# EAGLE schematic qcd-23 (EAGLE 7.2.0)
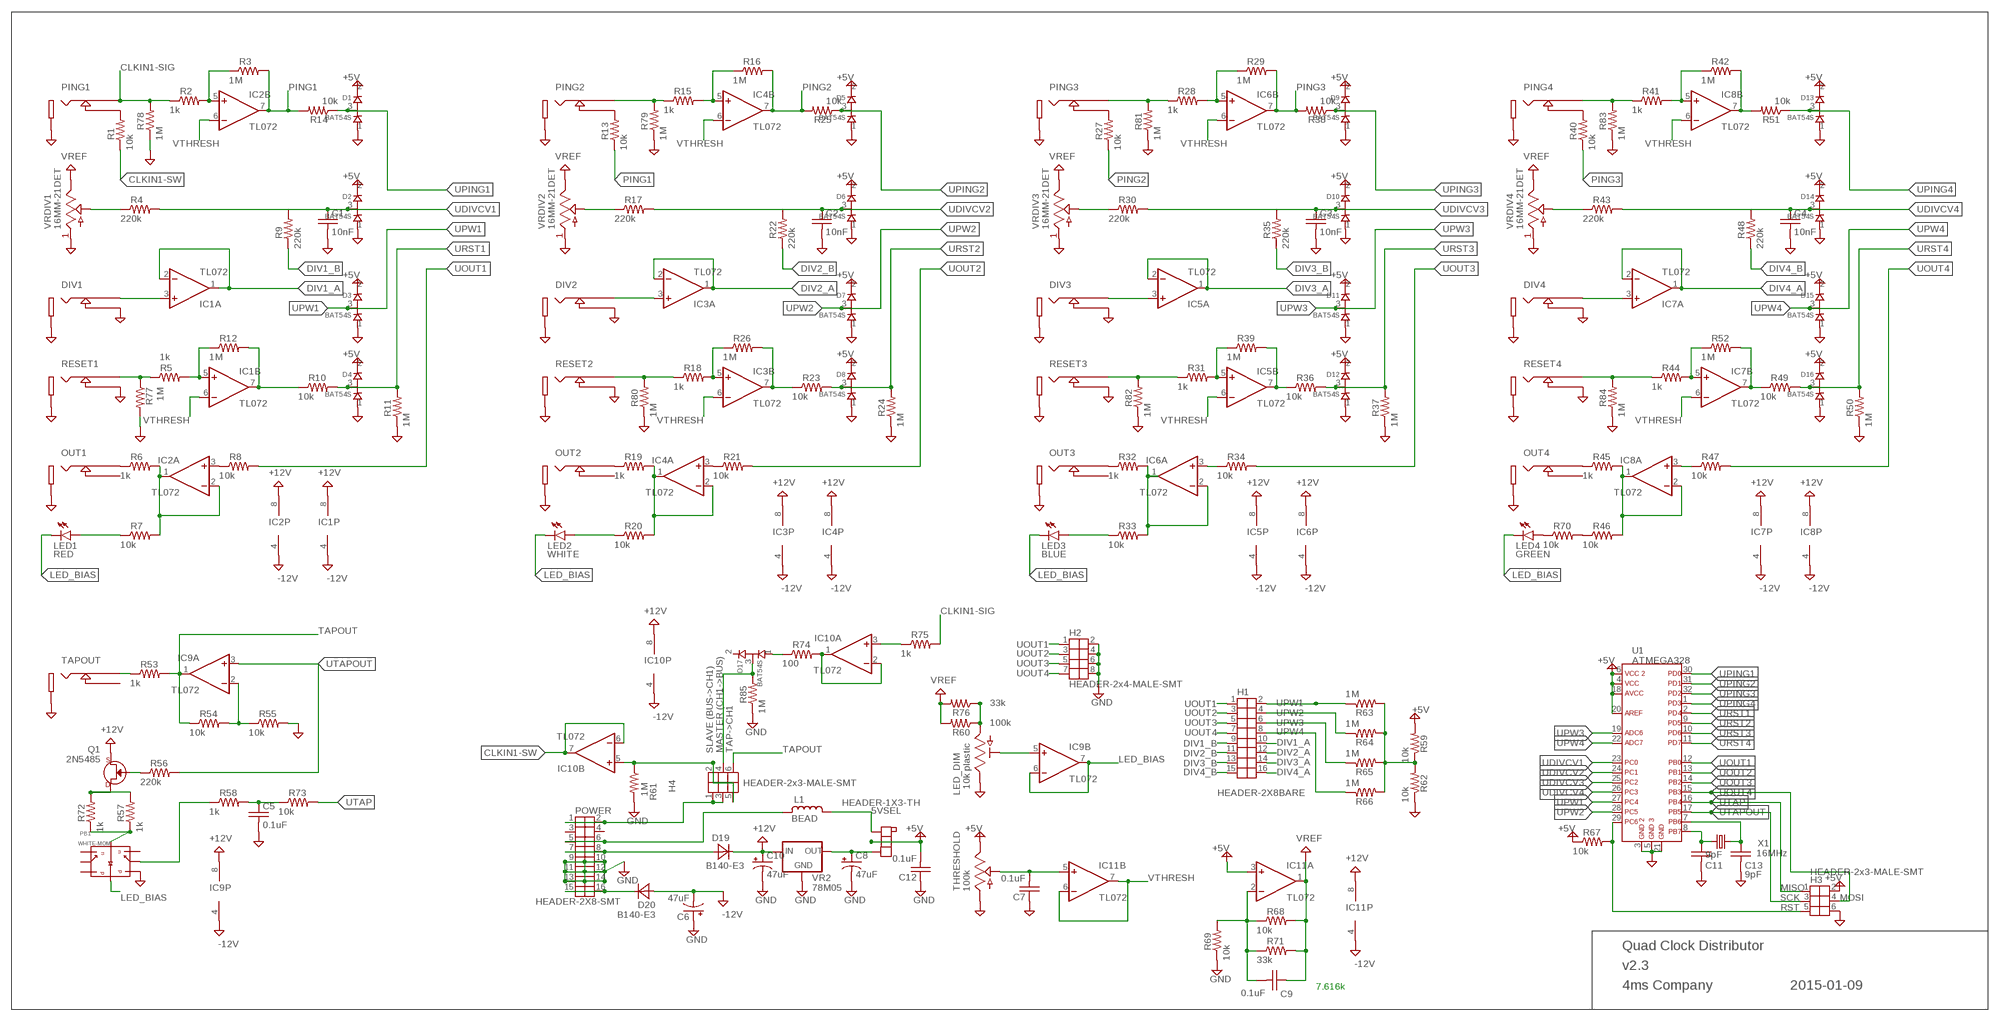
[diagram p0: schematic, sheet 1]

## Parts
5VSEL  HEADER-1X3-TH  HEADER-1X3  [HEADER-1X3-TH]
C1  10nF  CB  [C0603]
C2  10nF  CB  [C0603]
C3  10nF  CB  [C0603]
C4  10nF  CB  [C0603]
C5  0.1uF  CB  [C0603]
C6  47uF  C-POL5  [C-POL-5]
C7  0.1uF  CB  [C0603]
C8  47uF  C-POL5  [C-POL-5]
C9  0.1uF  CB  [C0603]
C10  47uF  C-POL5  [C-POL-5]
C11  9pF  CB  [C0603]
C12  0.1uF  CB  [C0603]
C13  9pF  CB  [C0603]
D1  BAT54S  DIODE-DUAL  [SOT23]
D2  BAT54S  DIODE-DUAL  [SOT23]
D3  BAT54S  DIODE-DUAL  [SOT23]
D4  BAT54S  DIODE-DUAL  [SOT23]
D5  BAT54S  DIODE-DUAL  [SOT23]
D6  BAT54S  DIODE-DUAL  [SOT23]
D7  BAT54S  DIODE-DUAL  [SOT23]
D8  BAT54S  DIODE-DUAL  [SOT23]
D9  BAT54S  DIODE-DUAL  [SOT23]
D10  BAT54S  DIODE-DUAL  [SOT23]
D11  BAT54S  DIODE-DUAL  [SOT23]
D12  BAT54S  DIODE-DUAL  [SOT23]
D13  BAT54S  DIODE-DUAL  [SOT23]
D14  BAT54S  DIODE-DUAL  [SOT23]
D15  BAT54S  DIODE-DUAL  [SOT23]
D16  BAT54S  DIODE-DUAL  [SOT23]
D17  BAT54S  DIODE-DUAL  [SOT23]
D19  B140-E3  DA  [SMA]
D20  B140-E3  DA  [SMA]
DIV1  JACK-MONO-SWM2  [PJ301M-12-FIX]
DIV2  JACK-MONO-SWM2  [PJ301M-12-FIX]
DIV3  JACK-MONO-SWM2  [PJ301M-12-FIX]
DIV4  JACK-MONO-SWM2  [PJ301M-12-FIX]
H1  HEADER-2X8BARE  [HEADER-2X8-SMT]
H2  HEADER-2x4-MALE-SMT  HEADER-2X4SMT  [HEADER-2X4-SMT]
H3  HEADER-2x3-MALE-SMT  HEADER-2X3SMT  [HEADER-2X3-SMT]
H4  HEADER-2x3-MALE-SMT  HEADER-2X3SMT  [HEADER-2X3-SMT]
IC1  TL072  OPAMP-2TL072T  [TSSOP8]
IC2  TL072  OPAMP-2TL072T  [TSSOP8]
IC3  TL072  OPAMP-2TL072T  [TSSOP8]
IC4  TL072  OPAMP-2TL072T  [TSSOP8]
IC5  TL072  OPAMP-2TL072T  [TSSOP8]
IC6  TL072  OPAMP-2TL072T  [TSSOP8]
IC7  TL072  OPAMP-2TL072T  [TSSOP8]
IC8  TL072  OPAMP-2TL072T  [TSSOP8]
IC9  TL072  OPAMP-2TL072T  [TSSOP8]
IC10  TL072  OPAMP-2TL072T  [TSSOP8]
IC11  TL072  OPAMP-2TL072T  [TSSOP8]
L1  BEAD  LB  [0603]
LED1  RED  LED  [LED-T1]
LED2  WHITE  LED  [LED-T1]
LED3  BLUE  LED  [LED-T1]
LED4  GREEN  LED  [LED-T1]
LED_DIM  10k plastic  POT-TRIMSQ  [TRIM-T73YE]
OUT1  JACK-MONO-SWM2  [PJ301M-12-FIX]
OUT2  JACK-MONO-SWM2  [PJ301M-12-FIX]
OUT3  JACK-MONO-SWM2  [PJ301M-12-FIX]
OUT4  JACK-MONO-SWM2  [PJ301M-12-FIX]
PB1  WHITE-MOM  BUTTON-LED  [BUTTON-LED-PB61303]
PING1  JACK-MONO-SWM2  [PJ301M-12-FIX]
PING2  JACK-MONO-SWM2  [PJ301M-12-FIX]
PING3  JACK-MONO-SWM2  [PJ301M-12-FIX]
PING4  JACK-MONO-SWM2  [PJ301M-12-FIX]
POWER  HEADER-2X8-SMT  HEADER-2X8BARE  [HEADER-2X8-SMT]
Q1  2N5485  JFET  [SOT23]
R1  10k  RB  [R0603]
R2  1k  RB  [R0603]
R3  1M  RB  [R0603]
R4  220k  RB  [R0603]
R5  1k  RB  [R0603]
R6  1k  RB  [R0603]
R7  10k  RB  [R0603]
R8  10k  RB  [R0603]
R9  220k  RB  [R0603]
R10  10k  RB  [R0603]
R11  1M  RB  [R0603]
R12  1M  RB  [R0603]
R13  10k  RB  [R0603]
R14  10k  RB  [R0603]
R15  1k  RB  [R0603]
R16  1M  RB  [R0603]
R17  220k  RB  [R0603]
R18  1k  RB  [R0603]
R19  1k  RB  [R0603]
R20  10k  RB  [R0603]
R21  10k  RB  [R0603]
R22  220k  RB  [R0603]
R23  10k  RB  [R0603]
R24  1M  RB  [R0603]
R25  10k  RB  [R0603]
R26  1M  RB  [R0603]
R27  10k  RB  [R0603]
R28  1k  RB  [R0603]
R29  1M  RB  [R0603]
R30  220k  RB  [R0603]
R31  1k  RB  [R0603]
R32  1k  RB  [R0603]
R33  10k  RB  [R0603]
R34  10k  RB  [R0603]
R35  220k  RB  [R0603]
R36  10k  RB  [R0603]
R37  1M  RB  [R0603]
R38  10k  RB  [R0603]
R39  1M  RB  [R0603]
R40  10k  RB  [R0603]
R41  1k  RB  [R0603]
R42  1M  RB  [R0603]
R43  220k  RB  [R0603]
R44  1k  RB  [R0603]
R45  1k  RB  [R0603]
R46  10k  RB  [R0603]
R47  10k  RB  [R0603]
R48  220k  RB  [R0603]
R49  10k  RB  [R0603]
R50  1M  RB  [R0603]
R51  10k  RB  [R0603]
R52  1M  RB  [R0603]
R53  1k  RB  [R0603]
R54  10k  RB  [R0603]
R55  10k  RB  [R0603]
R56  220k  RB  [R0603]
R57  1k  RB  [R0603]
R58  1k  RB  [R0603]
R59  10k  RB  [R0603]
R60  100k  RB  [R0603]
R61  1M  RB  [R0603]
R62  10k  RB  [R0603]
R63  1M  RB  [R0603]
R64  1M  RB  [R0603]
R65  1M  RB  [R0603]
R66  1M  RB  [R0603]
R67  10k  RB  [R0603]
R68  10k  RB  [R0603]
R69  10k  RB  [R0603]
R70  10k  RB  [R0603]
R71  33k  RB  [R0603]
R72  1k  RB  [R0603]
R73  10k  RB  [R0603]
R74  100  RB  [R0603]
R75  1k  RB  [R0603]
R76  33k  RB  [R0603]
R77  1M  RB  [R0603]
R78  1M  RB  [R0603]
R79  1M  RB  [R0603]
R80  1M  RB  [R0603]
R81  1M  RB  [R0603]
R82  1M  RB  [R0603]
R83  1M  RB  [R0603]
R84  1M  RB  [R0603]
R85  1M  RB  [R0603]
RESET1  JACK-MONO-SWM2  [PJ301M-12-FIX]
RESET2  JACK-MONO-SWM2  [PJ301M-12-FIX]
RESET3  JACK-MONO-SWM2  [PJ301M-12-FIX]
RESET4  JACK-MONO-SWM2  [PJ301M-12-FIX]
TAPOUT  JACK-MONO-SWM2  [PJ301M-12-FIX]
THRESHOLD  100k  POT-MI  [PIHER-6MM]
U1  ATMEGA328  ATMEGA168  [TQFP-32]
VR2  78M05  VREG-POS78A  [DPAK]
VRDIV1  16MM-21DET  POTRV16AF  [16MM-RV16AF-4A]
VRDIV2  16MM-21DET  POTRV16AF  [16MM-RV16AF-4A]
VRDIV3  16MM-21DET  POTRV16AF  [16MM-RV16AF-4A]
VRDIV4  16MM-21DET  POTRV16AF  [16MM-RV16AF-4A]
X1  16MHz  CRYSTALE  [FA-238]

## Nets
+5V: 5VSEL.P$2 C12.2 D1.2(CATHODE) D2.2(CATHODE) D3.2(CATHODE) D4.2(CATHODE) D5.2(CATHODE) D6.2(CATHODE) D7.2(CATHODE) D8.2(CATHODE) D9.2(CATHODE) D10.2(CATHODE) D11.2(CATHODE) D12.2(CATHODE) D13.2(CATHODE) D14.2(CATHODE) D15.2(CATHODE) D16.2(CATHODE) H3.2 IC11.3(A:+IN) R59.2 R67.1 THRESHOLD.3 U1.4 U1.6 U1.18 U1.20
+12V: C10.+ D19.K(C) IC1.8(P:V+) IC2.8(P:V+) IC3.8(P:V+) IC4.8(P:V+) IC5.8(P:V+) IC6.8(P:V+) IC7.8(P:V+) IC8.8(P:V+) IC9.8(P:V+) IC10.8(P:V+) IC11.8(P:V+) Q1.2(S) VR2.1(IN)
+VREF: C9.1 IC11.1(A:OUT) R60.2 R68.2 R71.2 R76.2 VRDIV1.3 VRDIV2.3 VRDIV3.3 VRDIV4.3 ; supply symbol labelled VREF
-12V: C6.- D20.A IC1.4(P:V-) IC2.4(P:V-) IC3.4(P:V-) IC4.4(P:V-) IC5.4(P:V-) IC6.4(P:V-) IC7.4(P:V-) IC8.4(P:V-) IC9.4(P:V-) IC10.4(P:V-) IC11.4(P:V-)
CLKIN1-SIG: PING1.1(TIP) R2.1 R75.2 R78.2
CLKIN1-SW: IC10.6(B:-IN) IC10.7(B:OUT) R1.1
DIV1_A: H1.10 IC1.1(A:OUT) IC1.2(A:-IN)
DIV1_B: H1.9 R9.1
DIV2_A: H1.12 IC3.1(A:OUT) IC3.2(A:-IN)
DIV2_B: H1.11 R22.1
DIV3_A: H1.14 IC5.1(A:OUT) IC5.2(A:-IN)
DIV3_B: H1.13 R35.1
DIV4_A: H1.16 IC7.1(A:OUT) IC7.2(A:-IN)
DIV4_B: H1.15 R48.1
GND: C1.2 C2.2 C3.2 C4.2 C5.2 C6.+ C7.1 C8.- C10.- C11.2 C12.1 C13.2 D1.1(ANODE) D2.1(ANODE) D3.1(ANODE) D4.1(ANODE) D5.1(ANODE) D6.1(ANODE) D7.1(ANODE) D8.1(ANODE) D9.1(ANODE) D10.1(ANODE) D11.1(ANODE) D12.1(ANODE) D13.1(ANODE) D14.1(ANODE) D15.1(ANODE) D16.1(ANODE) DIV1.2(SLEEVE) DIV1.3(TIP-SW) DIV2.2(SLEEVE) DIV2.3(TIP-SW) DIV3.2(SLEEVE) DIV3.3(TIP-SW) DIV4.2(SLEEVE) DIV4.3(TIP-SW) H2.2 H2.4 H2.6 H2.8 H3.6 LED_DIM.3 OUT1.2(SLEEVE) OUT2.2(SLEEVE) OUT3.2(SLEEVE) OUT4.2(SLEEVE) PB1.P$6 PING1.2(SLEEVE) PING2.2(SLEEVE) PING3.2(SLEEVE) PING4.2(SLEEVE) POWER.9 POWER.10 POWER.11 POWER.12 POWER.13 POWER.14 R11.1 R24.1 R37.1 R50.1 R55.2 R61.2 R62.1 R69.1 R77.2 R78.1 R79.1 R80.1 R81.1 R82.1 R83.1 R84.1 R85.1 RESET1.2(SLEEVE) RESET1.3(TIP-SW) RESET2.2(SLEEVE) RESET2.3(TIP-SW) RESET3.2(SLEEVE) RESET3.3(TIP-SW) RESET4.2(SLEEVE) RESET4.3(TIP-SW) TAPOUT.2(SLEEVE) THRESHOLD.1 U1.3 U1.5 U1.21 VR2.4(GND) VRDIV1.1 VRDIV2.1 VRDIV3.1 VRDIV4.1
LED_BIAS: IC9.6(B:-IN) IC9.7(B:OUT) LED1.K(C) LED2.K(C) LED3.K(C) LED4.K(C) PB1.P$8
N$1: PING1.3(TIP-SW) R1.2
N$2: IC10.3(A:+IN) R75.1
N$3: R5.1 R77.1 RESET1.1(TIP)
N$4: OUT1.1(TIP) R6.1
N$5: IC2.3(A:+IN) R8.1
N$6: IC1.5(B:+IN) R5.2 R12.1
N$7: IC2.5(B:+IN) R2.2 R3.1
N$8: DIV1.1(TIP) IC1.3(A:+IN)
N$9: R4.1 VRDIV1.2
N$10: PING2.3(TIP-SW) R13.2
N$11: PING2.1(TIP) R15.1 R79.2
N$12: R53.1 TAPOUT.1(TIP)
N$13: R18.1 R80.2 RESET2.1(TIP)
N$14: IC1.7(B:OUT) R10.1 R12.2
N$15: OUT2.1(TIP) R19.1
N$16: IC6.1(A:OUT) IC6.2(A:-IN) R32.2 R33.2
N$17: LED1.A R7.1
N$18: IC4.3(A:+IN) R21.1
N$19: IC3.5(B:+IN) R18.2 R26.1
N$20: IC4.5(B:+IN) R15.2 R16.1
N$21: IC4.1(A:OUT) IC4.2(A:-IN) R19.2 R20.2
N$22: R17.1 VRDIV2.2
N$23: R59.1 R62.2 R63.2 R64.2 R65.2 R66.2
N$24: IC3.7(B:OUT) R23.1 R26.2
N$25: IC2.1(A:OUT) IC2.2(A:-IN) R6.2 R7.2
N$26: LED2.A R20.1
N$27: PING3.3(TIP-SW) R27.2
N$28: PING3.1(TIP) R28.1 R81.2
N$29: R31.1 R82.2 RESET3.1(TIP)
N$30: OUT3.1(TIP) R32.1
N$31: DIV3.1(TIP) IC5.3(A:+IN)
N$32: IC5.5(B:+IN) R31.2 R39.1
N$33: IC6.5(B:+IN) R28.2 R29.1
N$34: D20.K(C) POWER.15 POWER.16
N$35: R30.1 VRDIV3.2
N$36: IC9.2(A:-IN) R54.2 R55.1
N$37: IC5.7(B:OUT) R36.1 R39.2
N$38: C9.2 IC11.2(A:-IN) R68.1 R69.2 R71.1
N$39: LED3.A R33.1
N$40: PING4.3(TIP-SW) R40.2
N$41: PING4.1(TIP) R41.1 R83.2
N$42: R44.1 R84.2 RESET4.1(TIP)
N$43: OUT4.1(TIP) R45.1
N$44: IC6.3(A:+IN) R34.1
N$45: IC7.5(B:+IN) R44.2 R52.1
N$46: IC8.5(B:+IN) R41.2 R42.1
N$47: LED4.A R70.1
N$48: R43.1 VRDIV4.2
N$49: IC8.7(B:OUT) R42.2 R51.2
N$50: IC7.7(B:OUT) R49.1 R52.2
N$51: C5.1 R58.2 R73.1
N$52: R46.1 R70.2
N$53: Q1.3(G) R56.1
N$54: IC8.1(A:OUT) IC8.2(A:-IN) R45.2 R46.2
N$55: C7.2 IC11.5(B:+IN) THRESHOLD.2
N$56: Q1.1(D) R57.2 R72.2
N$57: PB1.P$7 R57.1 R72.1
N$58: L1.1 POWER.5 POWER.6
N$59: PB1.P$5 R58.1
N$60: LED_DIM.1 R60.1 R76.1
N$61: IC9.5(B:+IN) LED_DIM.2
N$62: D19.A POWER.7 POWER.8
N$63: 5VSEL.P$3 C8.+ VR2.3(OUT)
N$64: 5VSEL.P$1 L1.2
N$65: H3.5 R67.2 U1.29
N$66: H4.1 H4.3 POWER.1 POWER.2
N$67: C11.1 U1.8 X1.3
N$68: H4.2 H4.5 IC10.5(B:+IN) R61.1
N$69: C13.1 U1.7 X1.1
N$70: DIV2.1(TIP) IC3.3(A:+IN)
N$71: IC10.1(A:OUT) IC10.2(A:-IN) R74.2
N$72: IC8.3(A:+IN) R47.1
N$73: DIV4.1(TIP) IC7.3(A:+IN)
N$74: D17.1(ANODE) R74.1
N$75: D17.3(COMMON) H4.4 R85.2
PING1: IC2.7(B:OUT) R3.2 R13.1 R14.2
PING2: IC4.7(B:OUT) R16.2 R25.2 R27.1
PING3: IC6.7(B:OUT) R29.2 R38.2 R40.1
TAPOUT: H4.6 IC9.1(A:OUT) R53.2 R54.1
UDIVCV1: C1.1 D2.3(COMMON) R4.2 R9.2 U1.23
UDIVCV2: C2.1 D6.3(COMMON) R17.2 R22.2 U1.24
UDIVCV3: C3.1 D10.3(COMMON) R30.2 R35.2 U1.25
UDIVCV4: C4.1 D14.3(COMMON) R43.2 R48.2 U1.26
UOUT1: H1.1 H2.1 R8.2 U1.12
UOUT2: H1.3 H2.3 R21.2 U1.13
UOUT3: H1.5 H2.5 R34.2 U1.14
UOUT4: H1.7 H2.7 H3.4 R47.2 U1.15
UPING1: D1.3(COMMON) R14.1 U1.30
UPING2: D5.3(COMMON) R25.1 U1.31
UPING3: D9.3(COMMON) R38.1 U1.32
UPING4: D13.3(COMMON) R51.1 U1.1
UPW1: D3.3(COMMON) H1.2 R63.1 U1.27
UPW2: D7.3(COMMON) H1.4 R64.1 U1.28
UPW3: D11.3(COMMON) H1.6 R65.1 U1.19
UPW4: D15.3(COMMON) H1.8 R66.1 U1.22
URST1: D4.3(COMMON) R10.2 R11.2 U1.2
URST2: D8.3(COMMON) R23.2 R24.2 U1.9
URST3: D12.3(COMMON) R36.2 R37.2 U1.10
URST4: D16.3(COMMON) R49.2 R50.2 U1.11
UTAP: H3.1 R73.2 U1.16
UTAPOUT: H3.3 IC9.3(A:+IN) R56.2 U1.17
VTHRESH: IC1.6(B:-IN) IC2.6(B:-IN) IC3.6(B:-IN) IC4.6(B:-IN) IC5.6(B:-IN) IC6.6(B:-IN) IC7.6(B:-IN) IC8.6(B:-IN) IC11.6(B:-IN) IC11.7(B:OUT)
Unconnected: D17.2(CATHODE) OUT1.3(TIP-SW) OUT2.3(TIP-SW) OUT3.3(TIP-SW) OUT4.3(TIP-SW) PB1.P$1 PB1.P$2 PB1.P$3 PB1.P$4 POWER.3 POWER.4 TAPOUT.3(TIP-SW)

## Notes on the sheet
- SLAVE (BUS->CH1) | MASTER (CH1->BUS) | TAP->CH1
- MISO
- SCK | MOSI
- RST
- Quad Clock Distributor
- v2.3
- 7.616k | 4ms Company | 2015-01-09

## Library data of the parts
5VSEL = 4ms-main-parts:HEADER-1X3: Male or Female Header 1x3 (35mil holes fits most square pins)
C1-C5 C7 C9 C11-C13 = 4ms-main-parts:C: Non-Polarized Capacitor
C6 C8 C10 = malekko main:C-POL: Polarized Capacitor
D1-D17 = 4ms-main-parts:DIODE-DUAL: ON Semi BAT54SLT1G Max Reverse Voltage: 30V Max Power Dissipation: 225mW Max Forward Current: 200mA Vdrop at 1mA, 25°C: 320mV Vdrop at 10mA: 400mV
D19 D20 = malekko main:D: Diode
DIV1-DIV4 OUT1-OUT4 PING1-PING4 RESET1-RESET4 TAPOUT = 4ms-main-parts:JACK-MONO-SW
H1 POWER = 4ms-main-parts:HEADER-2X8: SMT HEADER 2x8 Unshrouded: Cixi Langling LL1010-5C (HI TEMP 2*8PIN) Shrouded: Cixi Langling LL1007-3 (2*8PIN)
H2 = 4ms-main-parts:HEADER-2X4
H3 H4 = 4ms-main-parts:HEADER-2X3
IC1-IC11 = malekko main:OPAMP-2: Dual OPAMP
L1 = malekko main:L: Inductor; MOUSER: 875-MI0603K300R-10
LED1-LED4 = 4ms-main-parts:LED: LED
LED_DIM = 4ms-main-parts:POT-TRIM
PB1 = 4ms-main-parts:BUTTON-LED
Q1 = 4ms-main-parts:JFET
R1-R85 = malekko main:R: Resistor
THRESHOLD = malekko main:POT-M: Single Potentiometer
U1 = 4ms-main-parts:ATMEGA168
VR2 = malekko main:VREG-POS: Positive Voltage Regulator
VRDIV1-VRDIV4 = 4ms-main-parts:POT: PVZA: Murata series PVZ3A471C01R00 9MM POT SONGHUEI: Part number R0904N-B##VALUE## 16MM ALPHA: Part number RV16AF-4A-###
X1 = 4ms-main-parts:CRYSTAL: Crystal FA-238 could be Epson Timing #Q22FA2380xxxx00 (FA-238 16.0000MB or TSX-3225 16.0000MF10U-B0) Also matches footprint TSX-3225